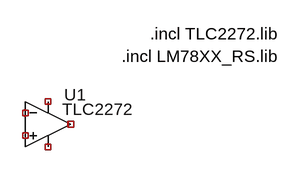
[diagram p0: schematic Draft1.asc]
Draft1.asc, the LTspice schematic file:
Version 4
SHEET 1 880 680
SYMBOL Opamps\\opamp2 144 96 R0
WINDOW 0 23 22 Left 2
WINDOW 3 20 43 Left 2
SYMATTR InstName U1
SYMATTR Value TLC2272
TEXT 288 32 Left 2 !.incl TLC2272.lib
TEXT 248 64 Left 2 !.incl LM78XX_RS.lib

The netlist it stands for:
* Draft1.asc
XU1 NC_01 NC_02 NC_03 NC_04 NC_05 TLC2272  ; pins In+ In- V+ V- OUT
.incl TLC2272.lib
.incl LM78XX_RS.lib
.backanno
.end